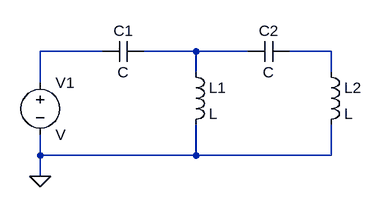
[diagram p0: schematic ejercicio1d.asc]
ejercicio1d.asc, the LTspice schematic file:
Version 4.1
SHEET 1 880 680
WIRE 160 96 64 96
WIRE 304 96 224 96
WIRE 384 96 304 96
WIRE 512 96 448 96
WIRE 304 128 304 96
WIRE 512 128 512 96
WIRE 64 144 64 96
WIRE 64 256 64 224
WIRE 304 256 304 208
WIRE 304 256 64 256
WIRE 512 256 512 208
WIRE 512 256 304 256
WIRE 64 288 64 256
FLAG 64 288 0
SYMBOL voltage 64 128 R0
SYMATTR InstName V1
SYMBOL cap 224 80 R90
WINDOW 0 0 32 VBottom 2
WINDOW 3 32 32 VTop 2
SYMATTR InstName C1
SYMBOL cap 448 80 R90
WINDOW 0 0 32 VBottom 2
WINDOW 3 32 32 VTop 2
SYMATTR InstName C2
SYMBOL ind 288 112 R0
SYMATTR InstName L1
SYMBOL ind 496 112 R0
SYMATTR InstName L2

The netlist it stands for:
* ejercicio1d.asc
V1 N001 0 V
C1 N002 N001 C
C2 N003 N002 C
L1 N002 0 L
L2 N003 0 L
.backanno
.end